# EAGLE design my (EAGLE 7.2.0)
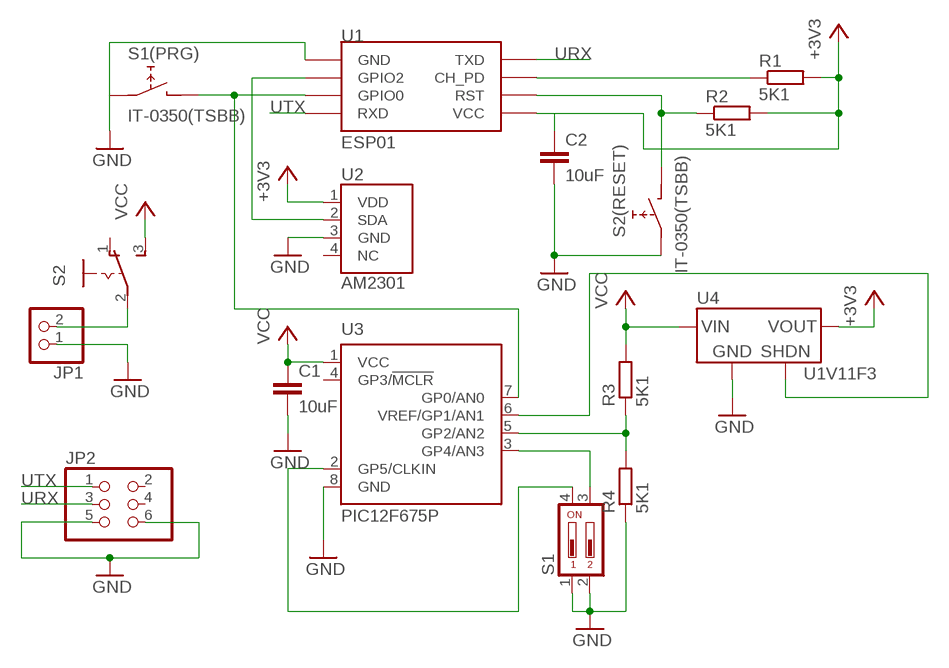
[diagram p0: schematic, sheet 1]

## Parts
C1  10uF  C-EUC3216  [C3216]
C2  10uF  C-EUC3216  [C3216]
JP1  PINHD-1X2/90  [1X02/90]
JP2  PINHD-2X3  [2X03]
R1  5K1  R-EU_R3216  [R3216]
R2  5K1  R-EU_R3216  [R3216]
R3  5K1  R-EU_R3216  [R3216]
R4  5K1  R-EU_R3216  [R3216]
S1  DS02  [DS-02]
S1(PRG)  IT-0350(TSBB)  [TL1105L-4,3]
S2  SS-12D00  [M251]
S2(RESET)  IT-0350(TSBB)  [TL1105L-4,3]
U1  ESP01  [ESP01]
U2  AM2301  [AM2301-NO-COVER]
U3  PIC12F675P  [DIL8]
U4  U1V11F3  [STEP-UP]

## Nets
+3V3: C2.1 R1.2 R2.2 U1.VCC U2.1(VDD) U4.VOUT
GND: C1.2 C2.2 JP1.1 JP2.5 JP2.6 R4.1 S1(PRG).1 S1.1 S1.2 S2(RESET).1 U1.GND U2.3(GND) U3.8(GND) U4.GND
N$1: R3.1 R4.2 U3.5(GP2/AN2)
N$2: R2.1 S2(RESET).2 U1.RST
N$3: S1(PRG).2 U1.GPIO0 U3.7(GP0/AN0)
N$4: U1.GPIO2 U2.2(SDA)
N$5: S1.4 U3.2(GP5/CLKIN)
N$6: S1.3 U3.3(GP4/AN3)
N$8: R1.1 U1.CH_PD
N$9: U3.6(VREF/GP1/AN1) U4.SHDN
N$10: JP1.2 S2.2(P)
URX: JP2.3 U1.TX(TXD)
UTX: JP2.1 U1.RX(RXD)
VCC: C1.1 R3.2 S2.3(S) U3.1(VCC) U4.VIN
Unconnected: JP2.2 JP2.4 S2.1(O) U2.4(NC) U3.4(GP3/!MCLR)

## Library data of the parts
C1 C2 = rcl:C-EU: CAPACITOR, European symbol
JP1 = my:PINHD-1X2: PIN HEADER
JP2 = my:PINHD-2X3: PIN HEADER
R1-R4 = rcl:R-EU_: RESISTOR, European symbol
S1 = my:DS02: DIL/CODE SWITCH; OC_FARNELL: 9472126; OC_NEWARK: unknown
S1(PRG) S2(RESET) = my:IT-0350(TSBB): IT-0350TSBB Size: 6x3x5mm
S2 = my:SS-12D00: SLIDING SWITCH Mors, distributor Buerklin, 11G702
U1 = my:ESP01: ESP8266 Wifi module 01
U2 = my:AM2301
U3 = my:PIC12F675: 8-Pin FLASH-Based 8-Bit CMOS Microcontroller Precision Internal 4 MHz oscillator factory calibrated to ±1% Low Power Features: Standby Current: - 1 nA @ 2.0V, typical Operating Current: - 8.5µA @ 32 kHz, 2.0V, typical - 100µA @ 1 MHz, 2.0V, typical Watchdog Timer Current: - 300 nA @ 2.0V, typical Timer1 oscillator current: - 4µA @ 32 kHz, 2.0V, typical Analog-to-Digital Converter module: - 10-bit resolution - Programmable 4-channel input - Voltage reference input Source: http://www.microchip.com .. 41190E.pdf; MF: MICROCHIP; MPN: PIC12F675-E/P; OC_FARNELL: 9759018; OC_NEWARK: 92C4340
U4 = my:U1V11F3: Pololu 3.3V Step-Up Voltage Regulator U1V11F3

## Board
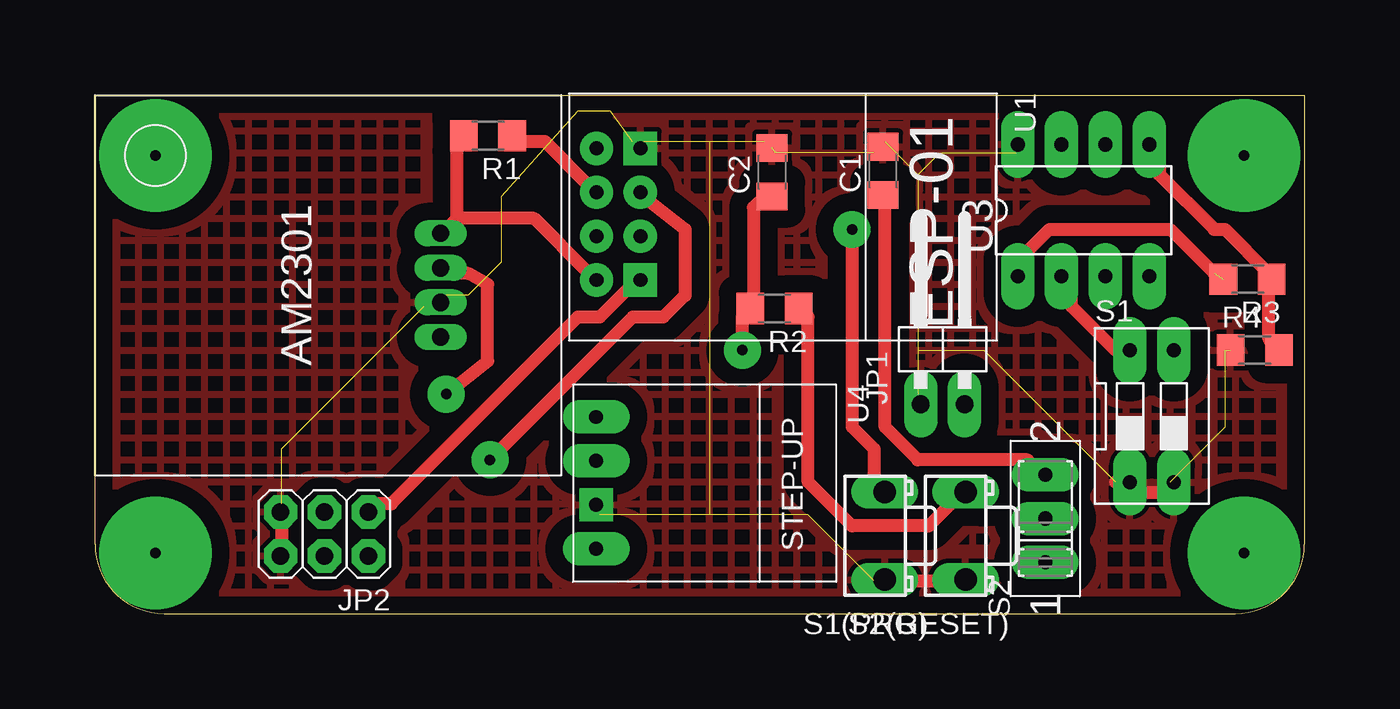
[diagram p1: board, top side]
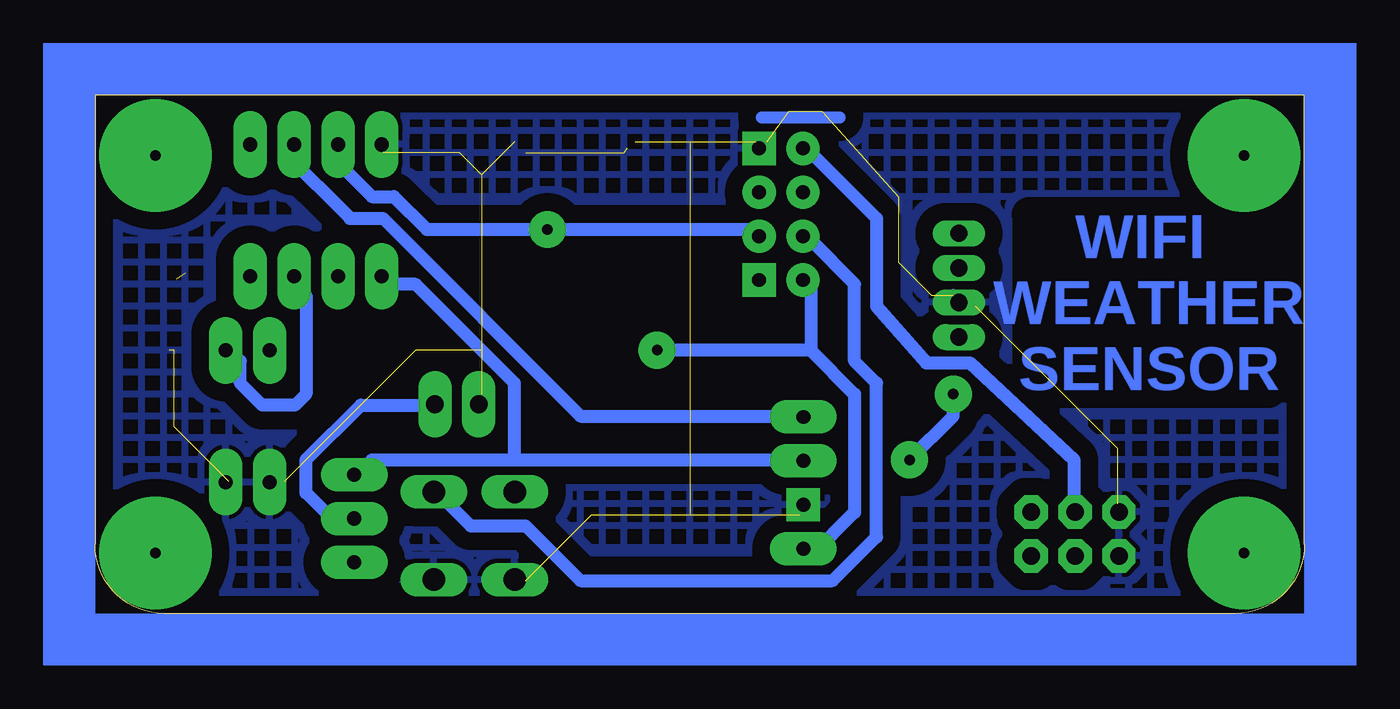
[diagram p2: board, bottom side, seen from below]

Size 70 x 30 mm. Coordinates in mm from the lower left corner, seen from the top.
Outline: 0,4 0,30 70,30 70,4 arc-90 66,0 4,0 arc-90 0,4
Copper layers (1*16): Top 0.035mm / dielectric 1.5mm / Bottom 0.035mm
Design rules "default *": minimum track width 30mil, minimum drill 24mil, track to track 20mil, track to pad 10mil, pad to pad 10mil, via to via 15mil, smd to smd 10mil, copper to edge 40mil, drill to drill 8mil, minimum pad ring 10mil, minimum via ring 30mil, stop-mask expansion 4mil, vias tented up to drill 0mil, thermal gap 10mil

### Footprints (pad centres in the part's own frame; a part is rotated, then mirrored left to right if it is on the bottom)
C3216 = smd 1.6 x 1.8: 1 -1.4,0; 2 1.4,0
1X02/90 = drill 1.016 pad 1.93 long: 1 -1.27,-3.81; 2 1.27,-3.81
2X03 = drill 1.016 pad 1.93 octagon: 1 -2.54,-1.27; 2 -2.54,1.27; 3 0,-1.27; 4 0,1.27; 5 2.54,-1.27; 6 2.54,1.27
R3216 = smd 1.6 x 1.8: 1 -1.4,0; 2 1.4,0
DS-02 = drill 0.813 pad 1.93 long: 1 -1.27,-3.81; 2 1.27,-3.81; 3 1.27,3.81; 4 -1.27,3.81
TL1105L-4,3 = drill 1.3 long: 1 -2.54,0; 2 2.54,0
M251 = drill 0.813 pad 1.93 long: 1 -2.54,0; 2 0,0; 3 2.54,0
ESP01 = drill 0.8 pad 1.93: CH_PD -1.285,-8.178; GPIO0 1.255,-5.638; GPIO2 -1.285,-5.638; RST 1.255,-8.178; TX -3.825,-8.178; VCC 3.795,-8.178 | drill 0.8 pad 1.93 square: GND -3.825,-5.638; RX 3.795,-5.638
AM2301-NO-COVER = drill 1 long: 1 3,-2; 2 1,-2; 3 -1,-2; 4 -3,-2
DIL8 = drill 0.813 pad 1.93 long: 1 -3.81,-3.81; 2 -1.27,-3.81; 3 1.27,-3.81; 4 3.81,-3.81; 5 3.81,3.81; 6 1.27,3.81; 7 -1.27,3.81; 8 -3.81,3.81
STEP-UP = drill 0.8 pad 1.93 square: GND 1.255,-8.178 | drill 0.8 pad 1.93 long: SHDN -3.825,-8.178; VIN -1.285,-8.178; VOUT 3.795,-8.178

### Placement (x,y rotation side)
C1  45.61,25.61 90 top
C2  39.19,25.54 90 top
JP1  49.06,15.92 0 top
JP2  13.28,4.61 180 top
R1  22.74,27.65 180 top
R2  39.32,17.65 180 top
R3  66.7,19.35 180 top
R4  67.12,15.25 0 top
S1  61.17,11.42 0 top
S1(PRG)  45.71,4.5 90 top
S2  55,5.5 90 top
S2(RESET)  50.39,4.5 90 top
U1  37.2,23.09 270 top
U2  18,19 90 top
U3  57.21,23.33 0 top
U4  37.18,7.55 270 top

### Tracks (layer width: path | path; a pad name or v marks a point on that pad's centre or on a via)
+3V3  (via drill 0.61)
  Top 0.762: 20.95,22.86 20.95,27.3 R1.2 | 20.95,22.86 20.32,22.23 U2.1 | C2.1 38.73,24.13 38.1,23.5 38.1,17.78 R2.2 37.47,17.14 v37.47,15.24 | 20.95,22.86 25.4,22.86 28.57,19.68 U1.VCC
  Bottom 0.762: 28.57,15.24 26.04,12.7 26.04,5.85 28.57,3.31 U4.VOUT | 28.57,15.24 28.57,19.05 U1.VCC | 28.57,15.24 v37.47,15.24
GND  (26 unrouted)
  Top 0.762: 29.21,5.71 U4.GND | 45.09,1.91 S1(PRG).1 45.72,1.91 50.16,1.91 S2(RESET).1 | 19.05,17.78 19.68,17.78 U2.3 | 10.79,6.35 JP2.5 10.79,5.71 10.79,3.81 JP2.6 | 62.23,7.62 S1.2 61.59,6.99 59.69,6.99 S1.1 59.05,7.62 | 45.09,26.67 C1.2 45.72,27.3 | 47.62,12.7 JP1.1 | 31.75,27.3 U1.GND | 38.73,27.3 C2.2 | 53.34,26.67 U3.8
  Bottom 0.762: 20.32,18.41 U2.3 | 31.11,27.3 U1.GND
  pour Bottom (isolate 1.016, hatched): 0,30 70,30 70,0 0,0
  pour Top (isolate 1.016, hatched): 0,30 70,30 70,0 0,0
N$1
  Top 0.762: R4.2 67.94,15.88 67.94,19.05 R3.1 67.94,19.68 65.41,22.23 64.77,22.23 61.59,25.4 61.59,26.67 U3.5
N$2
  Top 0.762: R2.1 41.27,17.14 41.27,7.62 43.81,5.08 48.26,5.08 50.16,6.99 S2(RESET).2
  Bottom 0.762: U1.RST 28.57,21.59 26.04,19.05 26.04,14.61 24.77,13.34 24.77,4.45 27.3,1.91 41.91,1.91 45.09,5.08 48.26,5.08 50.16,6.99 S2(RESET).2
N$3  (via drill 0.61)
  Top 0.762: v43.81,22.23 43.81,10.79 45.09,9.53 45.09,7.62 S1(PRG).2
  Bottom 0.762: U1.GPIO0 31.75,22.23 v43.81,22.23 50.8,22.23 52.7,24.13 53.98,24.13 56.52,26.67 U3.7
N$4  (via drill 0.61)
  Top 0.762: v20.32,12.7 22.73,14.61 22.73,19.05 21.59,19.68 20.32,19.68 U2.2 | v22.86,8.89 31.11,17.14 32.88,17.14 34.16,18.41 34.16,22.23 31.75,24.13 U1.GPIO2
  Bottom 0.762: v20.32,12.7 20.32,11.43 v22.86,8.89
N$5
  Top 0.762: U3.2 56.52,19.05 56.52,17.78 59.05,15.24 S1.4
N$6
  Bottom 0.762: S1.3 61.59,14.61 61.59,13.34 60.33,12.06 58.42,12.06 57.78,12.7 57.78,18.41 58.42,19.05 U3.3
N$7  (via drill 0.6 pad 6.5)
  other vias: 3.5,3.5
N$8
  Top 0.762: R1.1 24.77,27.3 26.04,27.3 28.57,24.77 U1.CH_PD
N$9
  Bottom 0.762: U4.SHDN 29.21,11.43 41.91,11.43 53.34,22.86 55.24,22.86 59.05,26.67 U3.6
N$10
  Bottom 0.762: JP1.2 50.8,12.06 54.61,12.06 57.78,8.89 57.78,6.99 56.52,5.71 55.24,5.71 S2.2
N$11  (via drill 0.6 pad 6.5)
  other vias: 3.5,26.5
N$12  (via drill 0.6 pad 6.5)
  other vias: 66.5,26.5
N$13  (via drill 0.6 pad 6.5)
  other vias: 66.5,3.5
N$14  (via drill 0.6 pad 6.5)
  other vias: -15,40 85,40 -15,-8 85,-8
N$15
  Bottom 0.05: 31.4,28.7 31,28.5
  Bottom 0.7: 26.9,28.7 31.4,28.7
URX
  Bottom 0.762: JP2.3 13.34,6.35 13.34,8.89 19.35,14.51 21.89,14.51 24.77,17.78 24.77,22.86 28.57,26.67 U1.TX
UTX
  Top 0.762: JP2.1 15.88,6.35 17.14,6.35 27.94,17.14 29.21,17.14 31.11,19.05 U1.RX
VCC  (1 unrouted)
  Top 0.762: 64.77,19.68 62.23,22.23 55.24,22.23 53.98,20.95 53.98,19.68 U3.1 | C1.1 45.72,24.13 45.72,10.79 47.62,8.89 53.98,8.89 54.61,8.26 S2.3
  Bottom 0.762: 45.72,8.89 53.98,8.89 54.61,8.26 S2.3 | 45.72,8.89 29.21,8.89 U4.VIN | 45.72,8.89 45.72,13.34 51.44,19.05 53.34,19.05 U3.1
(copper drawn outside any net)
  shapes: Bottom area x4

### Text on the board
Bottom: WIFI / WEATHER / SENSOR